# Altium schematic sheet connectors.SchDoc
size A; SheetNumber: 3; SheetTotal: 4
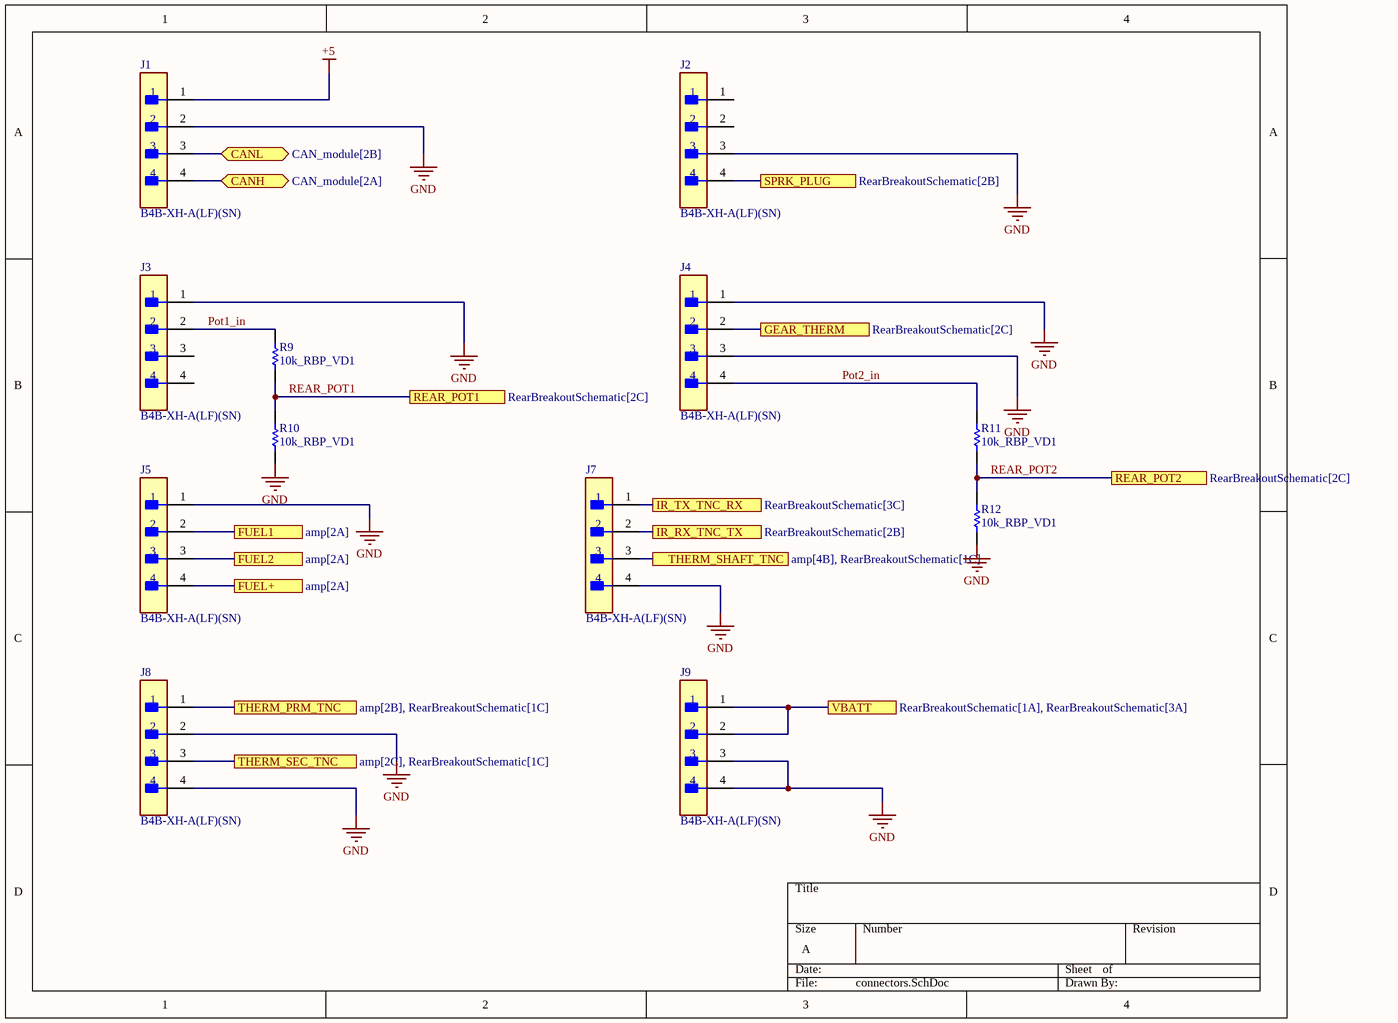
[diagram p0: connectors.SchDoc]

## Parts
J1  B4B-XH-A(LF)(SN)  [FP-B4B-XH-A_LF_SN-MFG]
J2  B4B-XH-A(LF)(SN)  [FP-B4B-XH-A_LF_SN-MFG]
J3  B4B-XH-A(LF)(SN)  [FP-B4B-XH-A_LF_SN-MFG]
J4  B4B-XH-A(LF)(SN)  [FP-B4B-XH-A_LF_SN-MFG]
J5  B4B-XH-A(LF)(SN)  [FP-B4B-XH-A_LF_SN-MFG]
J7  B4B-XH-A(LF)(SN)  [FP-B4B-XH-A_LF_SN-MFG]
J8  B4B-XH-A(LF)(SN)  [FP-B4B-XH-A_LF_SN-MFG]
J9  B4B-XH-A(LF)(SN)  [FP-B4B-XH-A_LF_SN-MFG]
R9  10k_RBP_VD1  [RESC2013X60X40LL20T25]
R10  10k_RBP_VD1  [RESC2013X60X40LL20T25]
R11  10k_RBP_VD1  [RESC2013X60X40LL20T25]
R12  10k_RBP_VD1  [RESC2013X60X40LL20T25]

## Ports
CANH (bidir, see CAN_module[2A]), CANL (bidir, see CAN_module[2B]), FUEL1 (see amp[2A]), FUEL2 (see amp[2A]), FUEL+ (see amp[2A]), GEAR_THERM (see RearBreakoutSchematic[2C]), IR_RX_TNC_TX (see RearBreakoutSchematic[2B]), IR_TX_TNC_RX (see RearBreakoutSchematic[3C]), REAR_POT1 (see RearBreakoutSchematic[2C]), REAR_POT2 (see RearBreakoutSchematic[2C]), SPRK_PLUG (see RearBreakoutSchematic[2B]), THERM_PRM_TNC (see amp[2B], RearBreakoutSchematic[1C]), THERM_SEC_TNC (see amp[2C], RearBreakoutSchematic[1C]), THERM_SHAFT_TNC (see amp[4B], RearBreakoutSchematic[1C]), VBATT (see RearBreakoutSchematic[1A], RearBreakoutSchematic[3A])

## Nets
+5: J1.1
GND: J1.2 J2.3 J3.1 J4.1 J4.3 J5.1 J7.4 J8.2 J8.4 J9.3 J9.4 R10.1 R12.1
CANH: J1.4 ; port CANH
CANL: J1.3 ; port CANL
FUEL1: J5.2 ; port FUEL1
FUEL2: J5.3 ; port FUEL2
FUEL+: J5.4 ; port FUEL+
GEAR_THERM: J4.2 ; port GEAR_THERM
IR_RX_TNC_TX: J7.2 ; port IR_RX_TNC_TX
IR_TX_TNC_RX: J7.1 ; port IR_TX_TNC_RX
Pot1_in: J3.2 R9.2
Pot2_in: J4.4 R11.2
REAR_POT1: R9.1 R10.2 ; port REAR_POT1
REAR_POT2: R11.1 R12.2 ; port REAR_POT2
SPRK_PLUG: J2.4 ; port SPRK_PLUG
THERM_PRM_TNC: J8.1 ; port THERM_PRM_TNC
THERM_SEC_TNC: J8.3 ; port THERM_SEC_TNC
THERM_SHAFT_TNC: J7.3 ; port THERM_SHAFT_TNC
VBATT: J9.1 J9.2 ; port VBATT

Not connected (* = marked no-connect by the designer): J2 1 2; J3 3 4

## Library data of the parts
J1-J5 J7-J9 = CMP-17439-000250-1: CONN HEADER VERT 4POS 2.5MM; Number of Contacts: 4; Contact Resistance: 20mR; Voltage Rating: 250V; Max Current Rating: 3A; Gender: Male; Wire/Cable Gauge: 22AWG; Mated Stacking Heights: 9.8mm; Insulation Resistance: 1GR; Orientation: Straight; Contact Type: Male Pin; Contact Finish - Mating: TIN; Series: XH; Max Voltage Rating (AC): 250V; Lead Pitch: 2.5mm; Contact Shape: Square; Insulation Color: Natural; Termination: Solder; Lead Free: Lead Free; Voltage Rating (AC): 250V; Number of Rows: 1; Flammability Rating: UL94 V-0; Number of Positions: 4; Max Operating Temperature: 85°C; Package Quantity: 500; Mount: Through Hole; REACH SVHC: No SVHC; Connector Type: Header; Insulation Material: Nylon; Fastening Type: Detent; Min Operating Temperature: -25°C; Housing Color: White; Packaging: Bulk; Contact Plating: Tin; Contact Material: Brass; Max Voltage Rating (DC): 250V; Housing Material: Polyamide; Color: Natural; Material: Polyamide; Pitch: 2.5mm; Depth: 5.75mm; Current Rating: 3A; Length: 12.4mm
R9-R12 = CMP-2001-00877-1: Manufacturer: Panasonic; Part Number: ERA6AEB7870V